# Altium schematic sheet HeartSchem.SchDoc
size A; SheetNumber: 1; SheetTotal: 1
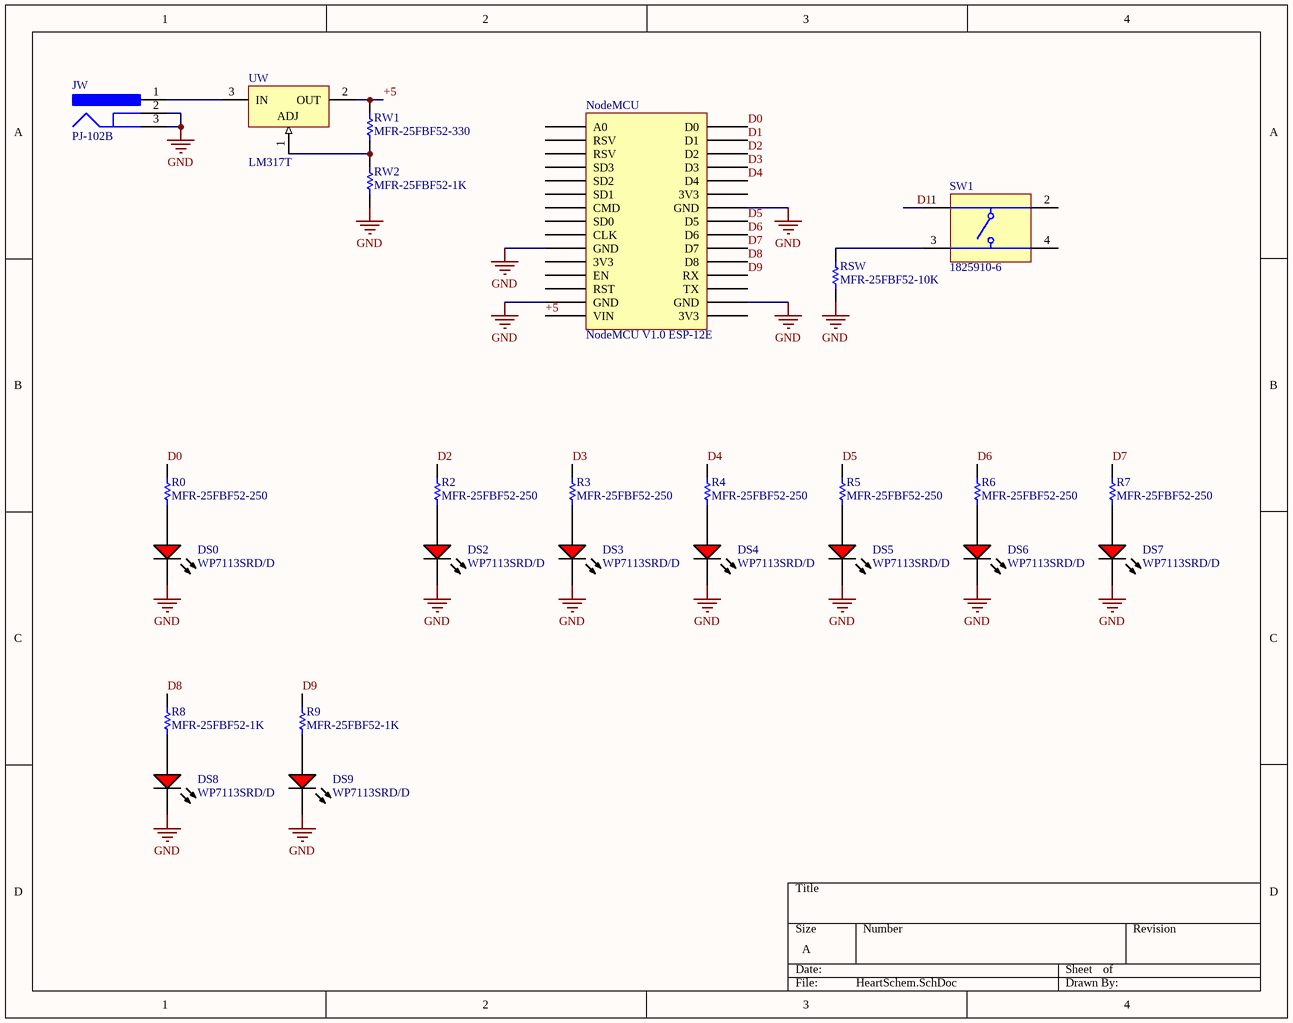
[diagram p0: HeartSchem.SchDoc]

## Parts
DS0  WP7113SRD/D  [KING-WP7113SRDD_V]
DS2  WP7113SRD/D  [KING-WP7113SRDD_V]
DS3  WP7113SRD/D  [KING-WP7113SRDD_V]
DS4  WP7113SRD/D  [KING-WP7113SRDD_V]
DS5  WP7113SRD/D  [KING-WP7113SRDD_V]
DS6  WP7113SRD/D  [KING-WP7113SRDD_V]
DS7  WP7113SRD/D  [KING-WP7113SRDD_V]
DS8  WP7113SRD/D  [KING-WP7113SRDD_V]
DS9  WP7113SRD/D  [KING-WP7113SRDD_V]
JW  PJ-102B  [CUI-PJ-102B_V]
NodeMCU  NodeMCU V1.0 ESP-12E  [NodeMCU V1.0 ESP-12E]
R0  MFR-25FBF52-250  [RESA60-630X240]
R2  MFR-25FBF52-250  [RESA60-630X240]
R3  MFR-25FBF52-250  [RESA60-630X240]
R4  MFR-25FBF52-250  [RESA60-630X240]
R5  MFR-25FBF52-250  [RESA60-630X240]
R6  MFR-25FBF52-250  [RESA60-630X240]
R7  MFR-25FBF52-250  [RESA60-630X240]
R8  MFR-25FBF52-1K  [RESA60-630X240]
R9  MFR-25FBF52-1K  [RESA60-630X240]
RSW  MFR-25FBF52-10K  [RESA60-630X240]
RW1  MFR-25FBF52-330  [RESA60-630X240]
RW2  MFR-25FBF52-1K  [RESA60-630X240]
SW1  1825910-6  [TECO-1825910-6_V]
UW  LM317T  [TO-220]

## Nets
GND: DS0.2(K) DS2.2(K) DS3.2(K) DS4.2(K) DS5.2(K) DS6.2(K) DS7.2(K) DS8.2(K) DS9.2(K) JW.2 JW.3 NodeMCU.GND RSW.2 RW2.2
+5: NodeMCU.VIN RW1.1 UW.2(OUT)
D0: NodeMCU.D0 R0.1
D1: NodeMCU.D1 SW1.1
D2: NodeMCU.D2 R2.1
D3: NodeMCU.D3 R3.1
D4: NodeMCU.D4 R4.1
D5: NodeMCU.D5 R5.1
D6: NodeMCU.D6 R6.1
D7: NodeMCU.D7 R7.1
D8: NodeMCU.D8 R8.1
D9: NodeMCU.RX R9.1
NetDS0_1: DS0.1(A) R0.2
NetDS2_1: DS2.1(A) R2.2
NetDS3_1: DS3.1(A) R3.2
NetDS4_1: DS4.1(A) R4.2
NetDS5_1: DS5.1(A) R5.2
NetDS6_1: DS6.1(A) R6.2
NetDS7_1: DS7.1(A) R7.2
NetDS8_1: DS8.1(A) R8.2
NetDS9_1: DS9.1(A) R9.2
NetJW_1: JW.1 UW.3(IN)
NetRSW_1: RSW.1 SW1.3
NetRW1_2: RW1.2 RW2.1 UW.1(ADJ)

Not connected (* = marked no-connect by the designer): NodeMCU 3V3 A0 CLK CMD EN RST RSV SD0 SD1 SD2 SD3 TX; SW1 2 4

## Library data of the parts
DS0 DS2-DS9 = CMP-007-00033-2: The Super Bright Red Source Color Device, 1.85 V, -40 to 85 degC, 2-Pin THD, RoHS, Tape and Reel; Manufacturer: Kingbright; Nominal Vf: 1.85V; Luminous Intensity: 300mcd; Viewing Angle: 30degrees; Lens Style: Diffused; RoHS Compliant: True; Datasheet Version: Rev. 6A, 07/2016; Illumination Colour: Red; Case/Package: Radial; Package Reference: WP7113SRDD; Package Quantity: 500; Datasheet URL: http://www.kingbrightusa.com/images/catalog/SPEC/WP7113SRD-D.pdf; Colour: Red; Packaging: Bulk; Forward Voltage: 1.85V; Mounting Technology: TH; Package Description: 2-Pin Through Hole Device, Dia 5.9 mm, Body Length 8.6 mm
JW = CMP-2000-06900-1: Through Hole Right Angle DC Power Jack, 2.5 A, 2.5 mm Center Pin, 3 Position, -25 to 85 degC, RoHS, Bulk; Manufacturer: CUIInc.; Insulation Resistance: 100MOhms; Inside Contact Diameter: 2.5mm; Outside Contact Diameter: 6.5mm; Voltage Rating: 24V; Current Rating: 2.5A; Brand: CUI; Datasheet URL: http://www.cui.com/product/resource/pj-102b.pdf; Housing Material: PolybutyleneTerephthalate(PBT); Operating Temperature Range: -25Cto+85C; Package Reference: PJ-102B; Factory Pack Quantity: 280; RoHS: True; Contact Material: Copper; Datasheet Version: Rev. 1.03, 04/2016; Product: Jacks; Mounting Angle: Right; Mounting Style: ThroughHole; Flammability Rating: UL94V-0; Product Category: DCPowerConnectors; Contact Gender: Male; Termination Style: ThroughHole; Manufacturer URL: http://www.cui.com/; Mounting Technology: ThroughHole; Package Description: 3-Pin Through Hole Device, Body 14.4 x 9 mm, Height 11 mm; Contact Plating: Nickel; Packaging: Bulk; Connector Type: DCPowerJack
NodeMCU = NodeMCU V1.0 ESP-12E: NodeMCU V1.0 ESP8266 (ESP-12E)
R0 R2-R9 RSW RW1 RW2 = CMP-1659-00075-1: Axial Resistor, 1 KOhm, +/- 1%, 250 mW, -55 to 155 degC, 2-Pin THD, RoHS, Bulk; Voltage Rating: 250 V; Resistance: 10 kohm; Power Rating: 250 mW; ComponentLink2Description: Datasheet; RoHSCompliant: true; PackageReference: MFR-25; Case\Package: Axial; Max Operating Temperature: 155 degC; DatasheetVersion: Apr-13; Tolerance: 1%; ComponentLink1URL: http://www.yageo.com/; Length: 0.248 inch; ComponentLink2URL: http://www.yageo.com/documents/recent/Yageo%20LR_MFR_2013.pdf; Packaging: Bulk; Package Quantity: 200; PackageDescription: 2-Pin Axial Lead, Dia 2.4 mm, Body Length 6.3 mm; Min Operating Temperature: -55 degC; ComponentLink1Description: Manufacturer URL
SW1 = CMP-1684-00021-1: Tact Switch, SPST-NO, 0.05 A, -35 to 85 degC, 4-Pin THD, RoHS, Bulk; Manufacturer: TE Connectivity; Maximum Contact Resistance: 100mOhm; Mechanical Life: 100000Cycles; Bushing Type: Unthreaded; Switch Configuration: OFF(ON); Maximum DC Voltage Rating: 24V; Contact Rating @ Voltage: 0.05A@24VDC; Actuator Color: Black; Body Orientation: Straight; Function: MomentaryContact; Illumination: N/R; Actuator Style: RoundButton; Actuator Material: PolybutyleneTerephthalate; Dielectric Strength: 500VAC; Pole Throw Configuration: SPST; Actuator Length: 1.4mm; Product Weight: N/A; Contact Material: CopperAlloy; Housing Material: N/A; Terminal Type: PCPins; Minimum Insulation Resistance: 100MOhm; Package Description: 4-Pin Through Hole Device, Body 5.99 x 5.99 mm, Pitch 6.5 mm; Part No: 1825910-6; Package Reference: THD; Base Material: N/A; Manufacturer URL: http://www.te.com; Contact Plating: Silver; RoHS: Yes; Datasheet Version: Rev. C9; Electrical Life: 100000Cycles; Maximum AC Voltage Rating: N/A; Thread Size: N/R; Operating Temperature: -35to85C; Mounting: ThroughHole; Dimension: 5.99x5mm; Datasheet URL: http://www.te.com/commerce/DocumentDelivery/DDEController?Action=showdoc&DocId=Customer+Drawing%7F1825910%7FC9%7Fpdf%7FEnglish%7FENG_CD_1825910_C9.pdf%7F1825910-6; Family: 1825910; Seal Location: N/A; Seal Description: N/A; Packaging: N/A
UW = CMP-0244-00444-1: 1.5A, 1.2V to 37V Adjustable Voltage Regulator, 3-Pin TO-220; PackageVersion: 2011; ComponentLink1URL: http://www.st.com; ComponentLink2URL: http://www.st.com/internet/com/TECHNICAL_RESOURCES/TECHNICAL_LITERATURE/DATASHEET/CD00000455.pdf; PackageDescription: TO, Thru-Hole, Vertical, Heatsink Mounted; 3 In-Line Leads; Pitch 2.54 mm; PackageReference: TO-220; ComponentLink1Description: Manufacturer URL; ComponentLink3URL: http://www.st.com/internet/com/TECHNICAL_RESOURCES/TECHNICAL_LITERATURE/PACKAGE_INFORMATION/CD00004649.pdf; DatasheetVersion: 1/11/2011; ComponentLink2Description: Datasheet; ComponentLink3Description: Package Specification